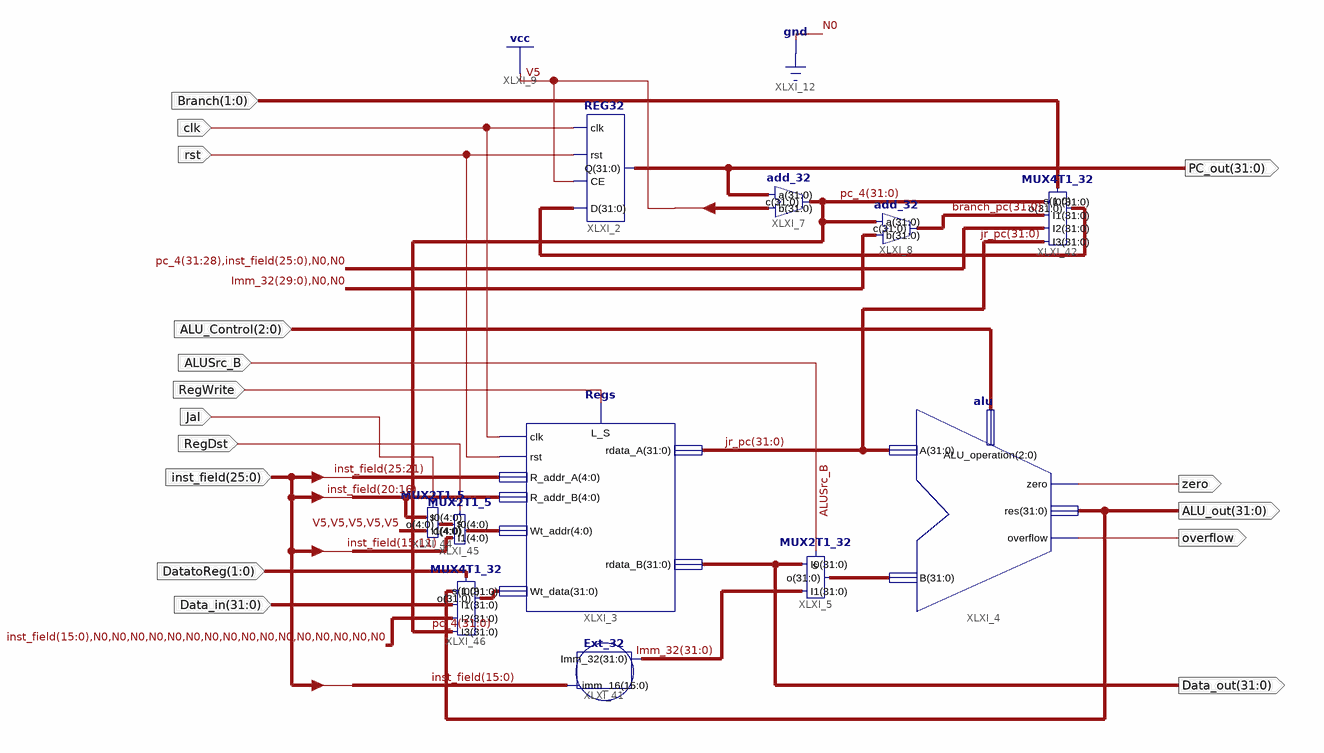
[diagram p0: schematic sheet 1]
// Xilinx ISE schematic SDPath_M.sch (kintex7) as structural Verilog: 11 symbols, 16 ports
module SDPath_M (
  input  clk,
  input  [2:0] ALU_Control,
  input  ALUSrc_B,
  input  RegWrite,
  input  rst,
  input  [31:0] Data_in,
  input  [25:0] inst_field,
  input  RegDst,
  input  Jal,
  input  [1:0] Branch,
  input  [1:0] DatatoReg,
  output [31:0] PC_out,
  output zero,
  output [31:0] ALU_out,
  output overflow,
  output [31:0] Data_out
);

  wire [4:0] XLXN_116, XLXN_118;
  wire [31:0] branch_pc, Imm_32, jr_pc, pc_4, XLXN_100, XLXN_119, XLXN_126;

  REG32 XLXI_2 (.D(XLXN_100), .CE(1'b1), .rst(rst), .clk(clk), .Q(PC_out));
  add_32 XLXI_7 (.c(pc_4), .a(PC_out), .b(32'b00000000000000000000000000000100));
  Regs XLXI_3 (
    .clk(clk), .L_S(RegWrite), .rdata_A(jr_pc), .rst(rst), .Wt_data(XLXN_119), .rdata_B(Data_out),
    .R_addr_A(inst_field[25:21]), .R_addr_B(inst_field[20:16]), .Wt_addr(XLXN_118));
  MUX2T1_32 XLXI_5 (.s(ALUSrc_B), .I0(Data_out), .I1(Imm_32), .o(XLXN_126));
  alu XLXI_4 (.zero(zero), .res(ALU_out), .overflow(overflow), .A(jr_pc), .B(XLXN_126), .ALU_operation(ALU_Control));
  Ext_32 XLXI_41 (.imm_16(inst_field[15:0]), .Imm_32(Imm_32));
  add_32 XLXI_8 (.c(branch_pc), .a(pc_4), .b({Imm_32[29:0], 2'b00}));
  MUX4T1_32 XLXI_42 (
    .s(Branch), .I0(pc_4), .I1(branch_pc), .I2({pc_4[31:28], inst_field, 2'b00}), .I3(jr_pc), .o(XLXN_100));
  MUX2T1_5 XLXI_44 (.I1({5{1'b1}}), .I0(inst_field[20:16]), .o(XLXN_116), .s(Jal));
  MUX2T1_5 XLXI_45 (.I1(inst_field[15:11]), .I0(XLXN_116), .o(XLXN_118), .s(RegDst));
  MUX4T1_32 XLXI_46 (
    .s(DatatoReg), .I0(ALU_out), .I1(Data_in), .I2({inst_field[15:0], {16{1'b0}}}), .I3(pc_4), .o(XLXN_119));
endmodule
